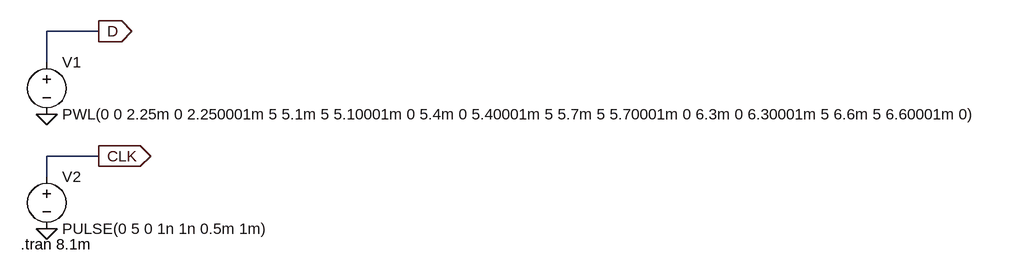
[diagram p0: schematic FFINPUTBLOCK2.asc]
FFINPUTBLOCK2.asc, the LTspice schematic file:
Version 4
SHEET 1 880 680
WIRE 272 -64 192 -64
WIRE 192 -16 192 -64
WIRE 272 128 192 128
WIRE 192 160 192 128
FLAG 192 240 0
FLAG 192 64 0
FLAG 272 128 CLK
IOPIN 272 128 Out
FLAG 272 -64 D
IOPIN 272 -64 Out
SYMBOL voltage 192 -32 R0
WINDOW 123 0 0 Left 0
WINDOW 39 0 0 Left 0
SYMATTR InstName V1
SYMATTR Value PWL(0 0 2.25m 0 2.250001m 5 5.1m 5 5.10001m 0 5.4m 0 5.40001m 5 5.7m 5 5.70001m 0 6.3m 0 6.30001m 5 6.6m 5 6.60001m 0)
SYMBOL voltage 192 144 R0
WINDOW 123 0 0 Left 0
WINDOW 39 0 0 Left 0
SYMATTR InstName V2
SYMATTR Value PULSE(0 5 0 1n 1n 0.5m 1m)
TEXT 152 264 Left 2 !.tran 8.1m

The netlist it stands for:
* FFINPUTBLOCK2.asc
V1 D 0 PWL(0 0 2.25m 0 2.250001m 5 5.1m 5 5.10001m 0 5.4m 0 5.40001m 5 5.7m 5 5.70001m 0 6.3m 0 6.30001m 5 6.6m 5 6.60001m 0)
V2 CLK 0 PULSE(0 5 0 1n 1n 0.5m 1m)
.tran 8.1m
.backanno
.end